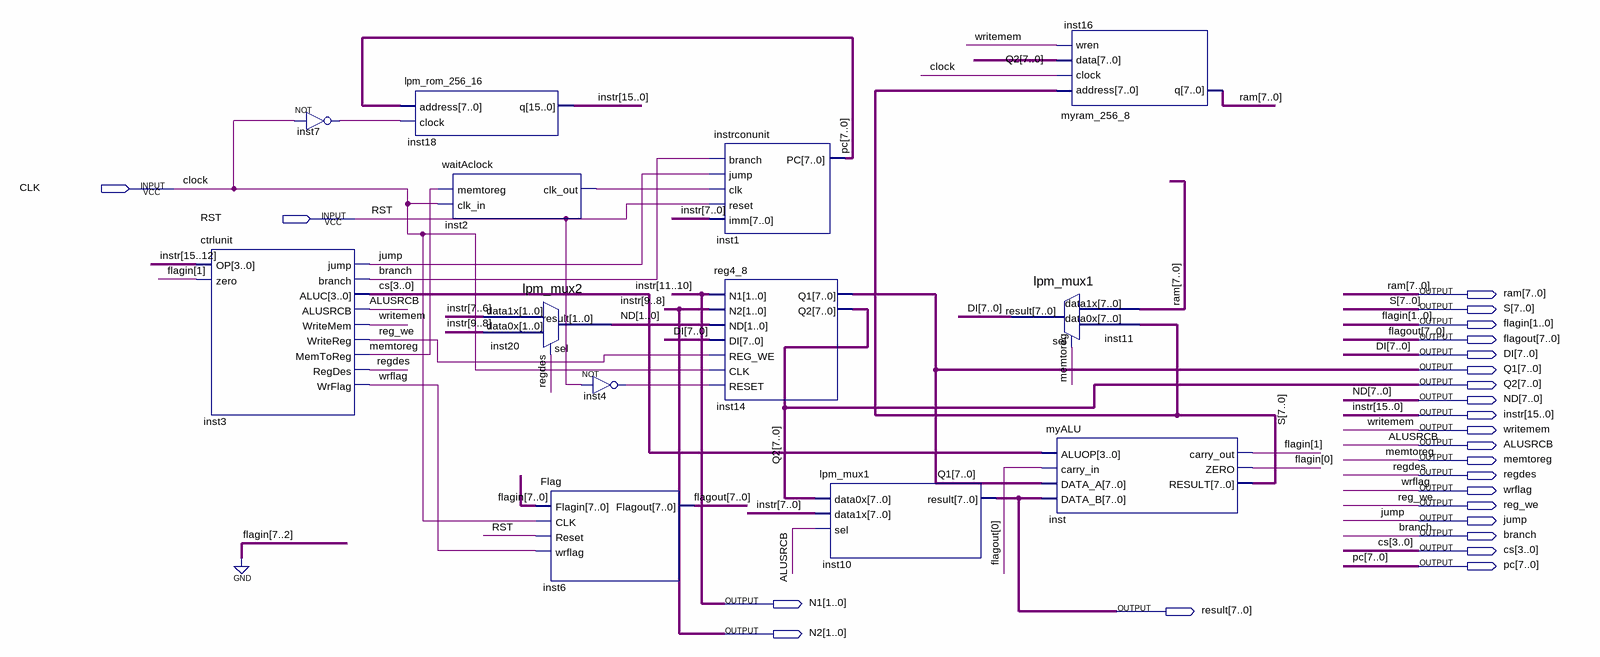
[diagram p0: schematic sheet]
// Quartus schematic systemA.bdf as structural Verilog: 13 symbols, 24 pins
module systemA (
  input  CLK,
  input  RST,
  output [7:0] ram,
  output [7:0] S,
  output [1:0] flagin,
  output [7:0] flagout,
  output [7:0] DI,
  output [7:0] Q1,
  output [7:0] Q2,
  output [7:0] ND,
  output [15:0] instr,
  output writemem,
  output ALUSRCB,
  output memtoreg,
  output regdes,
  output wrflag,
  output reg_we,
  output jump,
  output branch,
  output [3:0] cs,
  output [7:0] pc,
  output [1:0] N1,
  output [7:0] result,
  output [1:0] N2
);

  wire inst2_clk_out, inst4_out, inst7_out;

  ctrlunit inst3 (
    .OP(instr[15:12]), .zero(flagin[1]), .jump(jump), .branch(branch), .ALUC(cs), .ALUSRCB(ALUSRCB),
    .WriteMem(writemem), .WriteReg(reg_we), .MemToReg(memtoreg), .RegDes(regdes), .WrFlag(wrflag));
  not inst7 (inst7_out, CLK);
  lpm_rom_256_16 inst18 (.address(pc), .clock(inst7_out), .q(instr));
  waitAclock inst2 (.memtoreg(memtoreg), .clk_in(CLK), .clk_out(inst2_clk_out));
  lpm_mux2 inst20 (.data1x(instr[7:6]), .data0x(instr[9:8]), .sel(regdes), .result(ND[1:0]));
  Flag inst6 (.Flagin({{6{1'b0}}, flagin}), .CLK(CLK), .Reset(RST), .wrflag(wrflag), .Flagout(flagout));
  not inst4 (inst4_out, RST);
  instrconunit inst1 (.branch(branch), .jump(jump), .clk(inst2_clk_out), .reset(RST), .imm(instr[7:0]), .PC(pc));
  reg4_8 inst14 (
    .N2(instr[9:8]), .ND(ND[1:0]), .REG_WE(reg_we), .DI(DI), .CLK(CLK), .RESET(inst4_out), .N1(instr[11:10]),
    .Q2(Q2), .Q1(Q1));
  lpm_mux1 inst10 (.data0x(Q2), .data1x(instr[7:0]), .sel(ALUSRCB), .result(result));
  lpm_mux1 inst11 (.data1x(ram), .data0x(S), .sel(memtoreg), .result(DI));
  myram_256_8 inst16 (.address(S), .clock(CLK), .data(Q2), .wren(writemem), .q(ram));
  myALU inst (
    .ALUOP(cs), .carry_in(flagout[0]), .DATA_A(Q1), .DATA_B(result), .carry_out(flagin[1]), .ZERO(flagin[0]),
    .RESULT(S));

  assign N1 = instr[11:10];
  assign N2 = instr[9:8];

  // Other names for the same wires on the sheet: clock = CLK
endmodule
